# EAGLE design ME433Schematic (EAGLE 9.6.2)
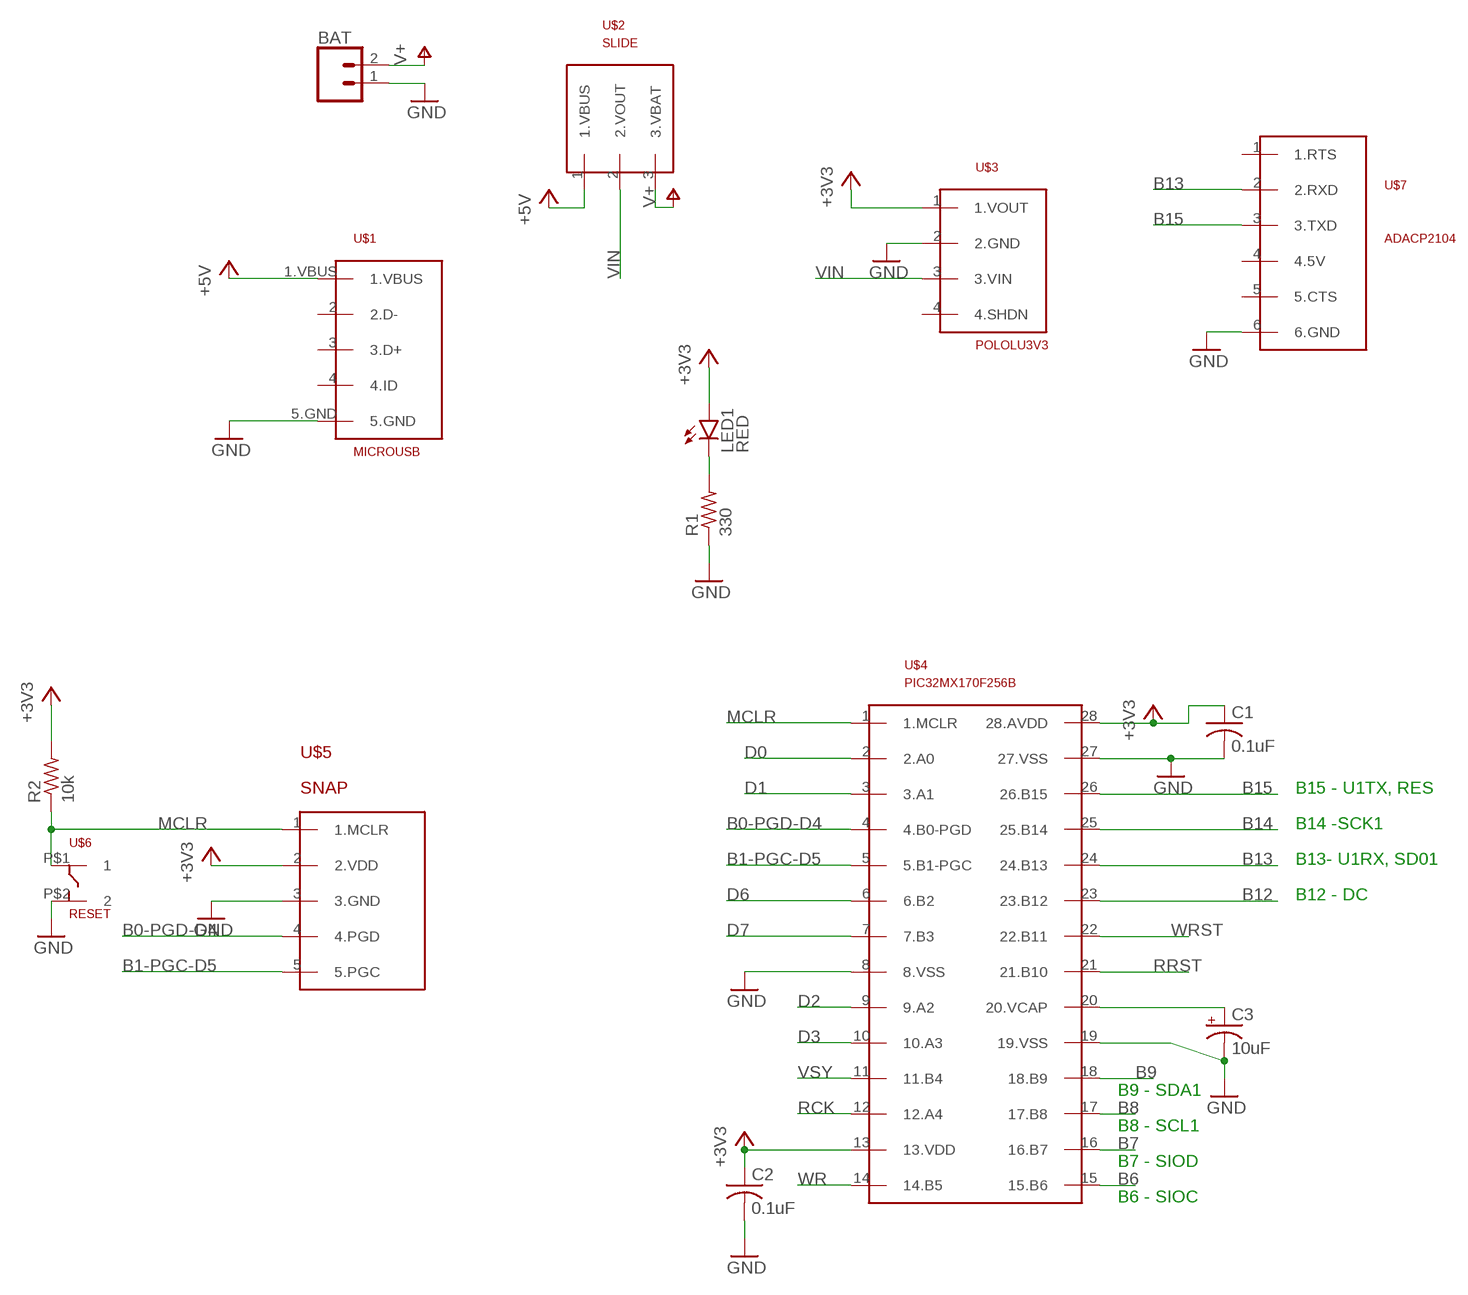
[diagram p0: schematic, sheet 1, part 1 of 2]
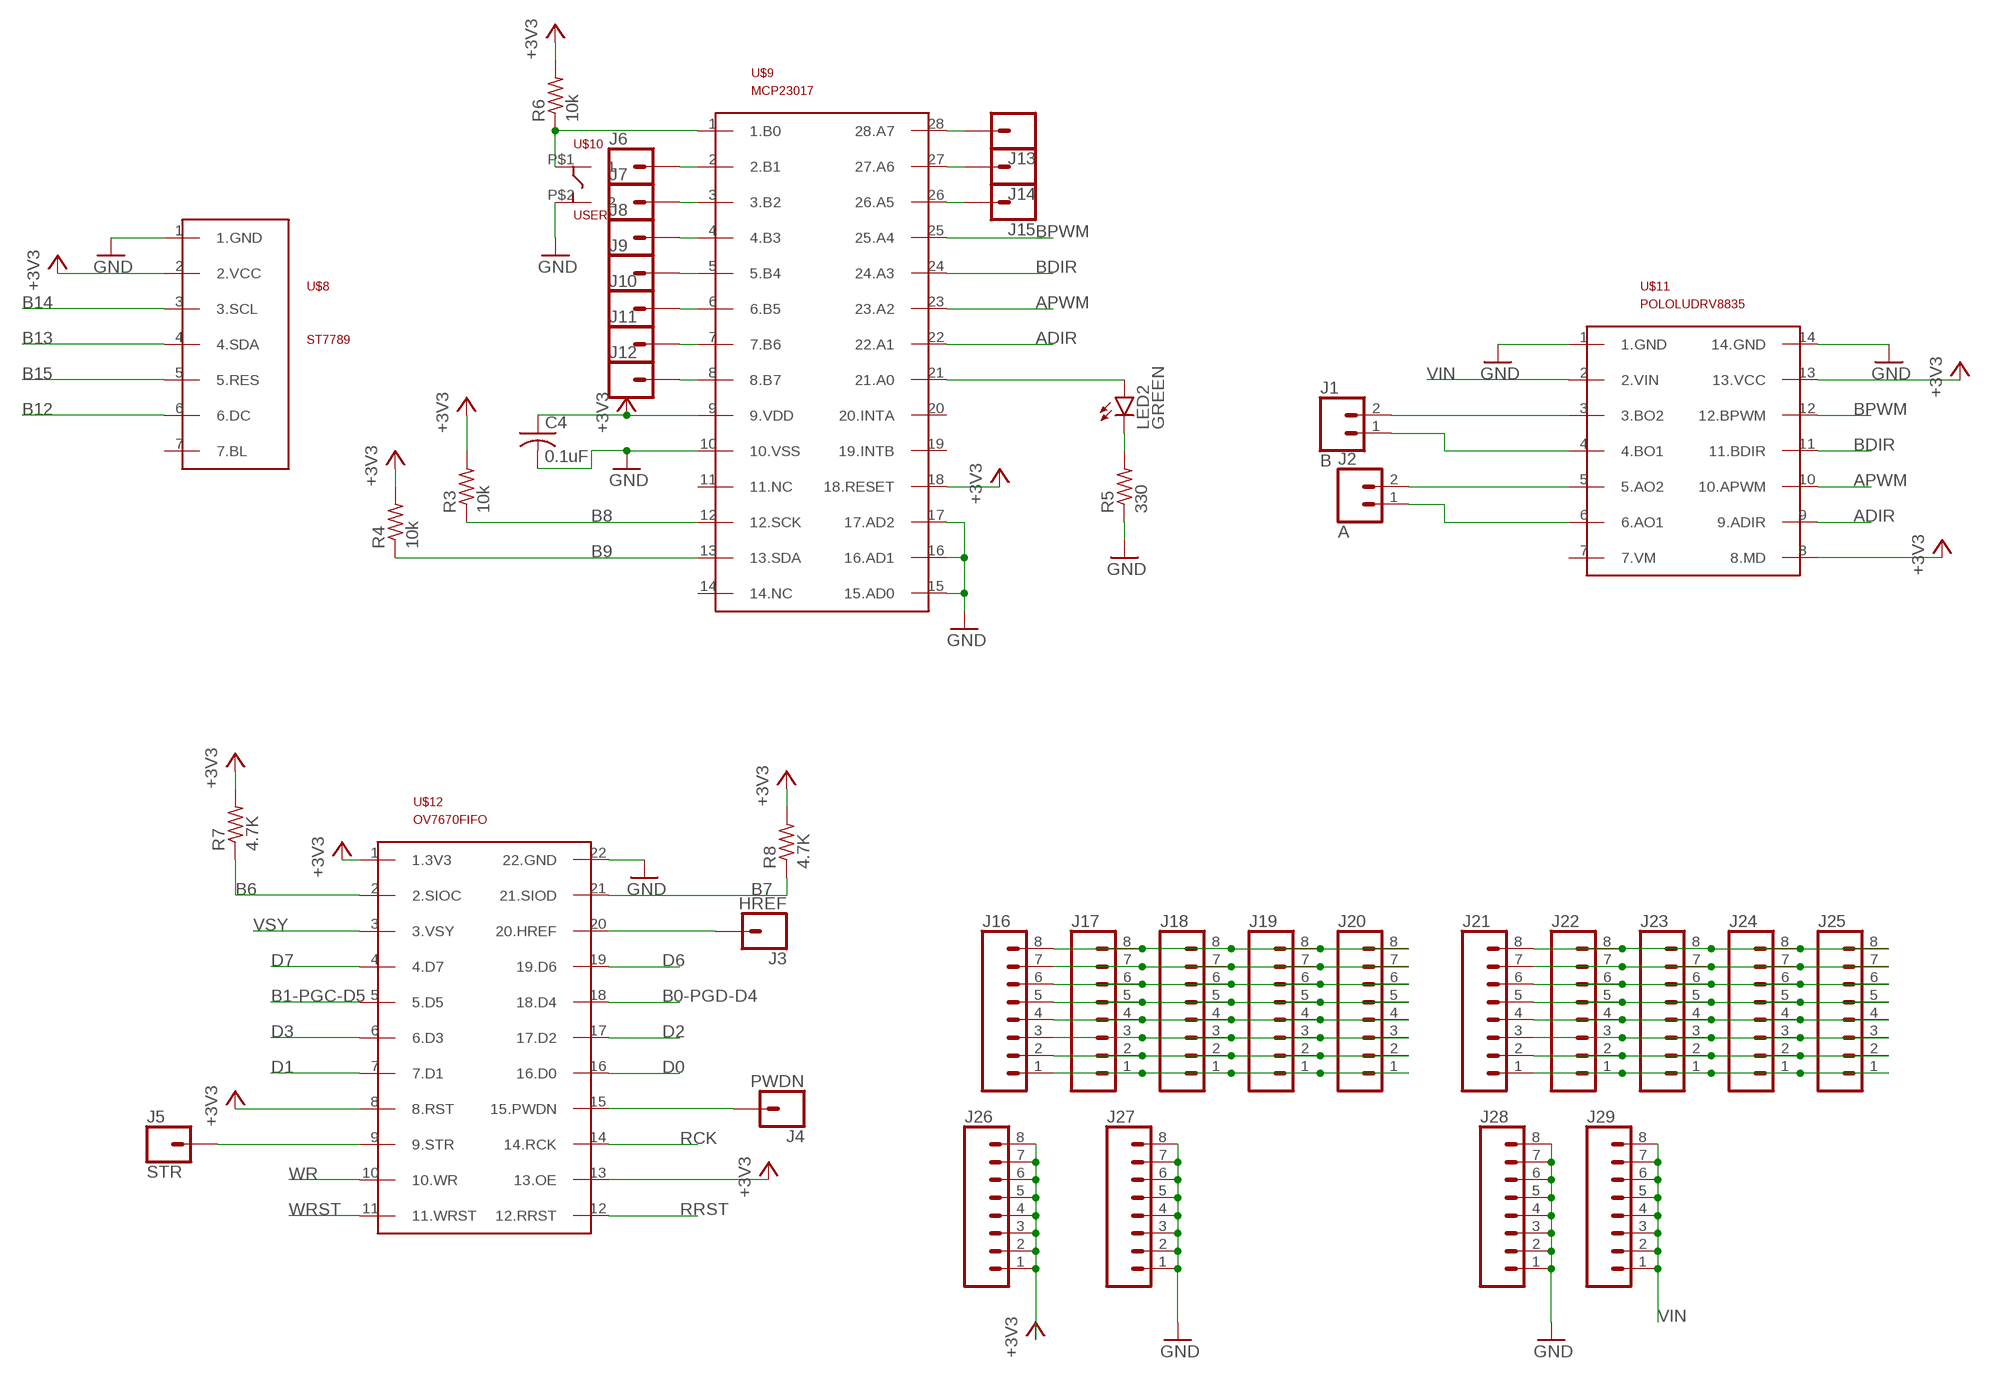
[diagram p1: schematic, sheet 1, part 2 of 2]

## Parts
BAT  CONN_02  [1X02]
C1  0.1uF  C-US025-030X050  [C025-030X050]
C2  0.1uF  C-US025-030X050  [C025-030X050]
C3  10uF  CPOL-USB45181B  [B45181B]
C4  0.1uF  C-US025-030X050  [C025-030X050]
J1  B  CONN_02  [1X02]
J2  A  CONN_02  [1X02]
J3  HREF  CONN_01  [1X01]
J4  PWDN  CONN_01  [1X01]
J5  STR  CONN_01  [1X01]
J6  CONN_01  [1X01]
J7  CONN_01  [1X01]
J8  CONN_01  [1X01]
J9  CONN_01  [1X01]
J10  CONN_01  [1X01]
J11  CONN_01  [1X01]
J12  CONN_01  [1X01]
J13  CONN_01  [1X01]
J14  CONN_01  [1X01]
J15  CONN_01  [1X01]
J16  CONN_08"  [1X08]
J17  CONN_08"  [1X08]
J18  CONN_08"  [1X08]
J19  CONN_08"  [1X08]
J20  CONN_08"  [1X08]
J21  CONN_08"  [1X08]
J22  CONN_08"  [1X08]
J23  CONN_08"  [1X08]
J24  CONN_08"  [1X08]
J25  CONN_08"  [1X08]
J26  CONN_08"  [1X08]
J27  CONN_08"  [1X08]
J28  CONN_08"  [1X08]
J29  CONN_08"  [1X08]
LED1  RED  LED3MM  [LED3MM]
LED2  GREEN  LED3MM  [LED3MM]
R1  330  R-US_0207/10  [0207/10]
R2  10k  R-US_0207/10  [0207/10]
R3  10k  R-US_0207/10  [0207/10]
R4  10k  R-US_0207/10  [0207/10]
R5  330  R-US_0207/10  [0207/10]
R6  10k  R-US_0207/10  [0207/10]
R7  4.7K  R-US_0207/10  [0207/10]
R8  4.7K  R-US_0207/10  [0207/10]
U$1  MICROUSB  [MICROUSB]
U$2  SLIDE  [SLIDE]
U$3  POLOLU3V3  [POLOLU3V3]
U$4  PIC32MX170F256B  [DIL28-3]
U$5  SNAP  [SNAP]
U$6  RESET  PUSH  [PUSH]
U$7  ADACP2104  [ADACP2104]
U$8  ST7789  [ST7789]
U$9  MCP23017  [DIL28-3]
U$10  USER  PUSH  [PUSH]
U$11  POLOLUDRV8835  [POLOLUDRV8835]
U$12  OV7670FIFO  [OV7670FIFO]

## Nets
+3V3: C1.1 C2.1 C4.1 J26.1 J26.2 J26.3 J26.4 J26.5 J26.6 J26.7 J26.8 LED1.A R2.2 R3.2 R4.2 R6.2 R7.2 R8.2 U$3.1(1.VOUT) U$4.13(13.VDD) U$4.28(28.AVDD) U$5.2(2.VDD) U$8.2(2.VCC) U$9.9(9.VDD) U$9.18(18.RESET) U$11.8(8.MD) U$11.13(13.VCC) U$12.1(1.3V3) U$12.8(8.RST) U$12.13(13.OE)
+5V: U$1.1.VBUS U$2.1(1.VBUS)
ADIR: U$9.22(22.A1) U$11.9(9.ADIR)
APWM: U$9.23(23.A2) U$11.10(10.APWM)
B0-PGD-D4: U$4.4(4.B0-PGD) U$5.4(4.PGD) U$12.18(18.D4)
B1-PGC-D5: U$4.5(5.B1-PGC) U$5.5(5.PGC) U$12.5(5.D5)
B6: R7.1 U$4.15(15.B6) U$12.2(2.SIOC)
B7: R8.1 U$4.16(16.B7) U$12.21(21.SIOD)
B8: R3.1 U$4.17(17.B8) U$9.12(12.SCK)
B9: R4.1 U$4.18(18.B9) U$9.13(13.SDA)
B12: U$4.23(23.B12) U$8.6(6.DC)
B13: U$4.24(24.B13) U$7.2(2.RXD) U$8.4(4.SDA)
B14: U$4.25(25.B14) U$8.3(3.SCL)
B15: U$4.26(26.B15) U$7.3(3.TXD) U$8.5(5.RES)
BDIR: U$9.24(24.A3) U$11.11(11.BDIR)
BPWM: U$9.25(25.A4) U$11.12(12.BPWM)
D0: U$4.2(2.A0) U$12.16(16.D0)
D1: U$4.3(3.A1) U$12.7(7.D1)
D2: U$4.9(9.A2) U$12.17(17.D2)
D3: U$4.10(10.A3) U$12.6(6.D3)
D6: U$4.6(6.B2) U$12.19(19.D6)
D7: U$4.7(7.B3) U$12.4(4.D7)
GND: BAT.1 C1.2 C2.2 C3.- C4.2 J27.1 J27.2 J27.3 J27.4 J27.5 J27.6 J27.7 J27.8 J28.1 J28.2 J28.3 J28.4 J28.5 J28.6 J28.7 J28.8 R1.1 R5.1 U$1.5.GND U$3.2(2.GND) U$4.8(8.VSS) U$4.19(19.VSS) U$4.27(27.VSS) U$5.3(3.GND) U$6.P$2 U$7.6(6.GND) U$8.1(1.GND) U$9.10(10.VSS) U$9.15(15.AD0) U$9.16(16.AD1) U$9.17(17.AD2) U$10.P$2 U$11.1(1.GND) U$11.14(14.GND) U$12.22(22.GND)
MCLR: R2.1 U$4.1(1.MCLR) U$5.1(1.MCLR) U$6.P$1
N$1: LED1.K(C) R1.2
N$2: C3.+ U$4.20(20.VCAP)
N$3: LED2.A U$9.21(21.A0)
N$4: J5.1 U$12.9(9.STR)
N$5: R6.1 U$9.1(1.B0) U$10.P$1
N$6: LED2.K(C) R5.2
N$7: J1.2 U$11.3(3.BO2)
N$8: J1.1 U$11.4(4.BO1)
N$9: J2.2 U$11.5(5.AO2)
N$10: J2.1 U$11.6(6.AO1)
N$11: J4.1 U$12.15(15.PWDN)
N$12: J3.1 U$12.20(20.HREF)
N$13: J6.1 U$9.2(2.B1)
N$14: J7.1 U$9.3(3.B2)
N$15: J8.1 U$9.4(4.B3)
N$16: J9.1 U$9.5(5.B4)
N$17: J10.1 U$9.6(6.B5)
N$18: J11.1 U$9.7(7.B6)
N$19: J12.1 U$9.8(8.B7)
N$20: J13.1 U$9.28(28.A7)
N$21: J14.1 U$9.27(27.A6)
N$22: J15.1 U$9.26(26.A5)
N$23: J16.8 J17.8 J18.8 J19.8 J20.8
N$24: J16.7 J17.7 J18.7 J19.7 J20.7
N$25: J16.6 J17.6 J18.6 J19.6 J20.6
N$26: J16.5 J17.5 J18.5 J19.5 J20.5
N$27: J16.4 J17.4 J18.4 J19.4 J20.4
N$28: J16.3 J17.3 J18.3 J19.3 J20.3
N$29: J16.2 J17.2 J18.2 J19.2 J20.2
N$30: J16.1 J17.1 J18.1 J19.1 J20.1
N$31: J21.8 J22.8 J23.8 J24.8 J25.8
N$32: J21.7 J22.7 J23.7 J24.7 J25.7
N$33: J21.6 J22.6 J23.6 J24.6 J25.6
N$34: J21.5 J22.5 J23.5 J24.5 J25.5
N$35: J21.4 J22.4 J23.4 J24.4 J25.4
N$36: J21.3 J22.3 J23.3 J24.3 J25.3
N$37: J21.2 J22.2 J23.2 J24.2 J25.2
N$38: J21.1 J22.1 J23.1 J24.1 J25.1
RCK: U$4.12(12.A4) U$12.14(14.RCK)
RRST: U$4.21(21.B10) U$12.12(12.RRST)
V+: BAT.2 U$2.3(3.VBAT)
VIN: J29.1 J29.2 J29.3 J29.4 J29.5 J29.6 J29.7 J29.8 U$2.2(2.VOUT) U$3.3(3.VIN) U$11.2(2.VIN)
VSY: U$4.11(11.B4) U$12.3(3.VSY)
WR: U$4.14(14.B5) U$12.10(10.WR)
WRST: U$4.22(22.B11) U$12.11(11.WRST)
Unconnected: U$1.2(2.D-) U$1.3(3.D+) U$1.4(4.ID) U$3.4(4.SHDN) U$7.1(1.RTS) U$7.4(4.5V) U$7.5(5.CTS) U$8.7(7.BL) U$9.11(11.NC) U$9.14(14.NC) U$9.19(19.INTB) U$9.20(20.INTA) U$11.7(7.VM)

## Notes on the sheet
- B15 - U1TX, RES
- B14 -SCK1
- B13- U1RX, SD01
- B12 - DC
- B9 - SDA1
- B8 - SCL1
- B7 - SIOD
- B6 - SIOC

## Library data of the parts
BAT J1 J2 = ME433Library:CONN_02: Multi connection point. Often used as Generic Header-pin footprint for 0.1 inch spaced/style header connections On any of the 0.1 inch spaced packages, you can populate with these: Break Away Headers - Straight <https://www.sparkfun.com/products/116> (PRT-00116) Break Away Male Headers - Right Angle <https://www.sparkfun.com/products/553> (PRT-00553) Female Headers <https://www.sparkfun.com/products/115> (PRT-00115) Break Away Headers - Machine Pin <https://www.sparkfun.com/products/117> (PRT-00117) Break Away Female Headers - Swiss Machine Pin <https://www.sparkfun.com/products/743> (PRT-00743) For SCREWTERMINALS and SPRING TERMINALS visit here: Screw Terimnals on SparkFun.com <https://www.sparkfun.com/search/results?term=Screw+Terminals> (5mm/3.5mm/2.54mm spacing) This device is also useful as a general connection point to wire up your design to another part of your project. Our various solder wires solder well into these plated through hole pads. Hook-Up Wire - Assortment (Stranded, 22 AWG) <https://www.sparkfun.com/products/11375> (PRT-11375) Hook-Up Wire - Assortment (Solid Core, 22 AWG) <https://www.sparkfun.com/products/11367> (PRT-11367) View the entire wire category on our website here <https://www.sparkfun.com/categories/141> Special notes: Molex polarized connector foot print use with: PRT-08233 with associated crimp pins and housings. 2.54_SCREWTERM for use with PRT-10571. 3.5mm Screw Terminal footprints for PRT-08084 5mm Screw Terminal footprints for use with PRT-08432
C1 C2 C4 = ME433Library:C-US: CAPACITOR, American symbol; SPICEPREFIX: C
C3 = ME433Library:CPOL-US: POLARIZED CAPACITOR, American symbol; SPICEPREFIX: C
J3-J15 = ME433Library:CONN_01: Single connection point. Often used as Generic Header-pin footprint for 0.1 inch spaced/style header connections On any of the 0.1 inch spaced packages, you can populate with these: Break Away Headers - Straight <https://www.sparkfun.com/products/116> (PRT-00116) Break Away Male Headers - Right Angle <https://www.sparkfun.com/products/553> (PRT-00553) Female Headers <https://www.sparkfun.com/products/115> (PRT-00115) Break Away Headers - Machine Pin <https://www.sparkfun.com/products/117> (PRT-00117) Break Away Female Headers - Swiss Machine Pin <https://www.sparkfun.com/products/743> (PRT-00743) This device is also useful as a general connection point to wire up your design to another part of your project. Our various solder wires solder well into these plated through hole pads. Hook-Up Wire - Assortment (Stranded, 22 AWG) <https://www.sparkfun.com/products/11375> (PRT-11375) Hook-Up Wire - Assortment (Solid Core, 22 AWG) <https://www.sparkfun.com/products/11367> (PRT-11367) View the entire wire category on our website here <https://www.sparkfun.com/categories/141> Special notes: SMTSO-256-ET is a "flush mount" nut for a 4-40 screw. We mostly use this on specialty testbeds; it is a nice way to connect hardware to your PCB at an adjustable hieght. Also note, the SNAP packages are for using a snappable style connector. We sell a baggie of snaps and they are also used on two LilyPad designs: Snap Assortment - 30 pack (male and female) <https://www.sparkfun.com/products/11347> (DEV-11347) LilyPad Arduino SimpleSnap <https://www.sparkfun.com/products/10941> (DEV-10941) LilyPad SimpleSnap Protoboard <https://www.sparkfun.com/products/10940> (DEV-10940)
J16-J29 = ME433Library:CONN_08: Multi connection point. Often used as Generic Header-pin footprint for 0.1 inch spaced/style header connections On any of the 0.1 inch spaced packages, you can populate with these: Break Away Headers - Straight <https://www.sparkfun.com/products/116> (PRT-00116) Break Away Male Headers - Right Angle <https://www.sparkfun.com/products/553> (PRT-00553) Female Headers <https://www.sparkfun.com/products/115> (PRT-00115) Break Away Headers - Machine Pin <https://www.sparkfun.com/products/117> (PRT-00117) Break Away Female Headers - Swiss Machine Pin <https://www.sparkfun.com/products/743> (PRT-00743) Arduino Stackable Header - 8 Pin <https://www.sparkfun.com/products/9279> (PRT-09279) For SCREWTERMINALS and SPRING TERMINALS visit here: Screw Terimnals on SparkFun.com <https://www.sparkfun.com/search/results?term=Screw+Terminals> (5mm/3.5mm/2.54mm spacing) This device is also useful as a general connection point to wire up your design to another part of your project. Our various solder wires solder well into these plated through hole pads. Hook-Up Wire - Assortment (Stranded, 22 AWG) <https://www.sparkfun.com/products/11375> (PRT-11375) Hook-Up Wire - Assortment (Solid Core, 22 AWG) <https://www.sparkfun.com/products/11367> (PRT-11367) View the entire wire category on our website here <https://www.sparkfun.com/categories/141> Special notes: Molex polarized connector foot print use with SKU : PRT-08231 with associated crimp pins and housings. 1MM SMD Version SKU: PRT-10208 NOTES ON THE VARIANTS LOCK and LOCK_LONGPADS... This footprint was designed to help hold the alignment of a through-hole component (i.e. 6-pin header) while soldering it into place. You may notice that each hole has been shifted either up or down by 0.005 of an inch from it's more standard position (which is a perfectly straight line). This slight alteration caused the pins (the squares in the middle) to touch the edges of the holes. Because they are alternating, it causes a "brace" to hold the component in place. 0.005 has proven to be the perfect amount of "off-center" position when using our standard breakaway headers. Although looks a little odd when you look at the bare footprint, once you have a header in there, the alteration is very hard to notice. Also,if you push a header all the way into place, it is covered up entirely on the bottom side.; PROD_ID: CONN-08438
LED1 LED2 = ME433Library:LED: LED OSRAM: - CHIPLED LG R971, LG N971, LY N971, LG Q971, LY Q971, LO R971, LY R971 LH N974, LH R974 LS Q976, LO Q976, LY Q976 LO Q996 - Hyper CHIPLED LW Q18S LB Q993, LB Q99A, LB R99A - SideLED LS A670, LO A670, LY A670, LG A670, LP A670 LB A673, LV A673, LT A673, LW A673 LH A674 LY A675 LS A676, LA A676, LO A676, LY A676, LW A676 LS A679, LY A679, LG A679 - Hyper Micro SIDELED® LS Y876, LA Y876, LO Y876, LY Y876 LT Y87S - SmartLED LW L88C, LW L88S LB L89C, LB L89S, LG L890 LS L89K, LO L89K, LY L89K LS L896, LA L896, LO L896, LY L896 - TOPLED LS T670, LO T670, LY T670, LG T670, LP T670 LSG T670, LSP T670, LSY T670, LOP T670, LYG T670 LG T671, LOG T671, LSG T671 LB T673, LV T673, LT T673, LW T673 LH T674 LS T676, LA T676, LO T676, LY T676, LB T676, LH T676, LSB T676, LW T676 LB T67C, LV T67C, LT T67C, LS T67K, LO T67K, LY T67K, LW E67C LS E67B, LA E67B, LO E67B, LY E67B, LB E67C, LV E67C, LT E67C LW T67C LS T679, LY T679, LG T679 LS T770, LO T770, LY T770, LG T770, LP T770 LB T773, LV T773, LT T773, LW T773 LH T774 LS E675, LA E675, LY E675, LS T675 LS T776, LA T776, LO T776, LY T776, LB T776 LHGB T686 LT T68C, LB T68C - Hyper Mini TOPLED® LB M676 - Mini TOPLED Santana® LG M470 LS M47K, LO M47K, LY M47K Source: http://www.osram.convergy.de LUXEON: - LUMILED® LXK2-PW12-R00, LXK2-PW12-S00, LXK2-PW14-U00, LXK2-PW14-V00 LXK2-PM12-R00, LXK2-PM12-S00, LXK2-PM14-U00 LXK2-PE12-Q00, LXK2-PE12-R00, LXK2-PE12-S00, LXK2-PE14-T00, LXK2-PE14-U00 LXK2-PB12-K00, LXK2-PB12-L00, LXK2-PB12-M00, LXK2-PB14-N00, LXK2-PB14-P00, LXK2-PB14-Q00 LXK2-PR12-L00, LXK2-PR12-M00, LXK2-PR14-Q00, LXK2-PR14-R00 LXK2-PD12-Q00, LXK2-PD12-R00, LXK2-PD12-S00 LXK2-PH12-R00, LXK2-PH12-S00 LXK2-PL12-P00, LXK2-PL12-Q00, LXK2-PL12-R00 Source: www.luxeon.com KINGBRIGHT: KA-3528ASYC Source: www.kingbright.com
R1-R8 = ME433Library:R-US_: RESISTOR, American symbol; SPICEPREFIX: R
U$1 = ME433Library:MICROUSB
U$2 = ME433Library:SLIDE
U$3 = ME433Library:POLOLU3V3
U$4 = ME433Library:PIC32MX170F256B
U$5 = ME433Library:SNAP
U$6 U$10 = ME433Library:PUSH
U$7 = ME433Library:ADACP2104
U$8 = ME433Library:ST7789
U$9 = ME433Library:MCP23017
U$11 = ME433Library:POLOLUDRV8835
U$12 = ME433Library:OV7670FIFO

## Board
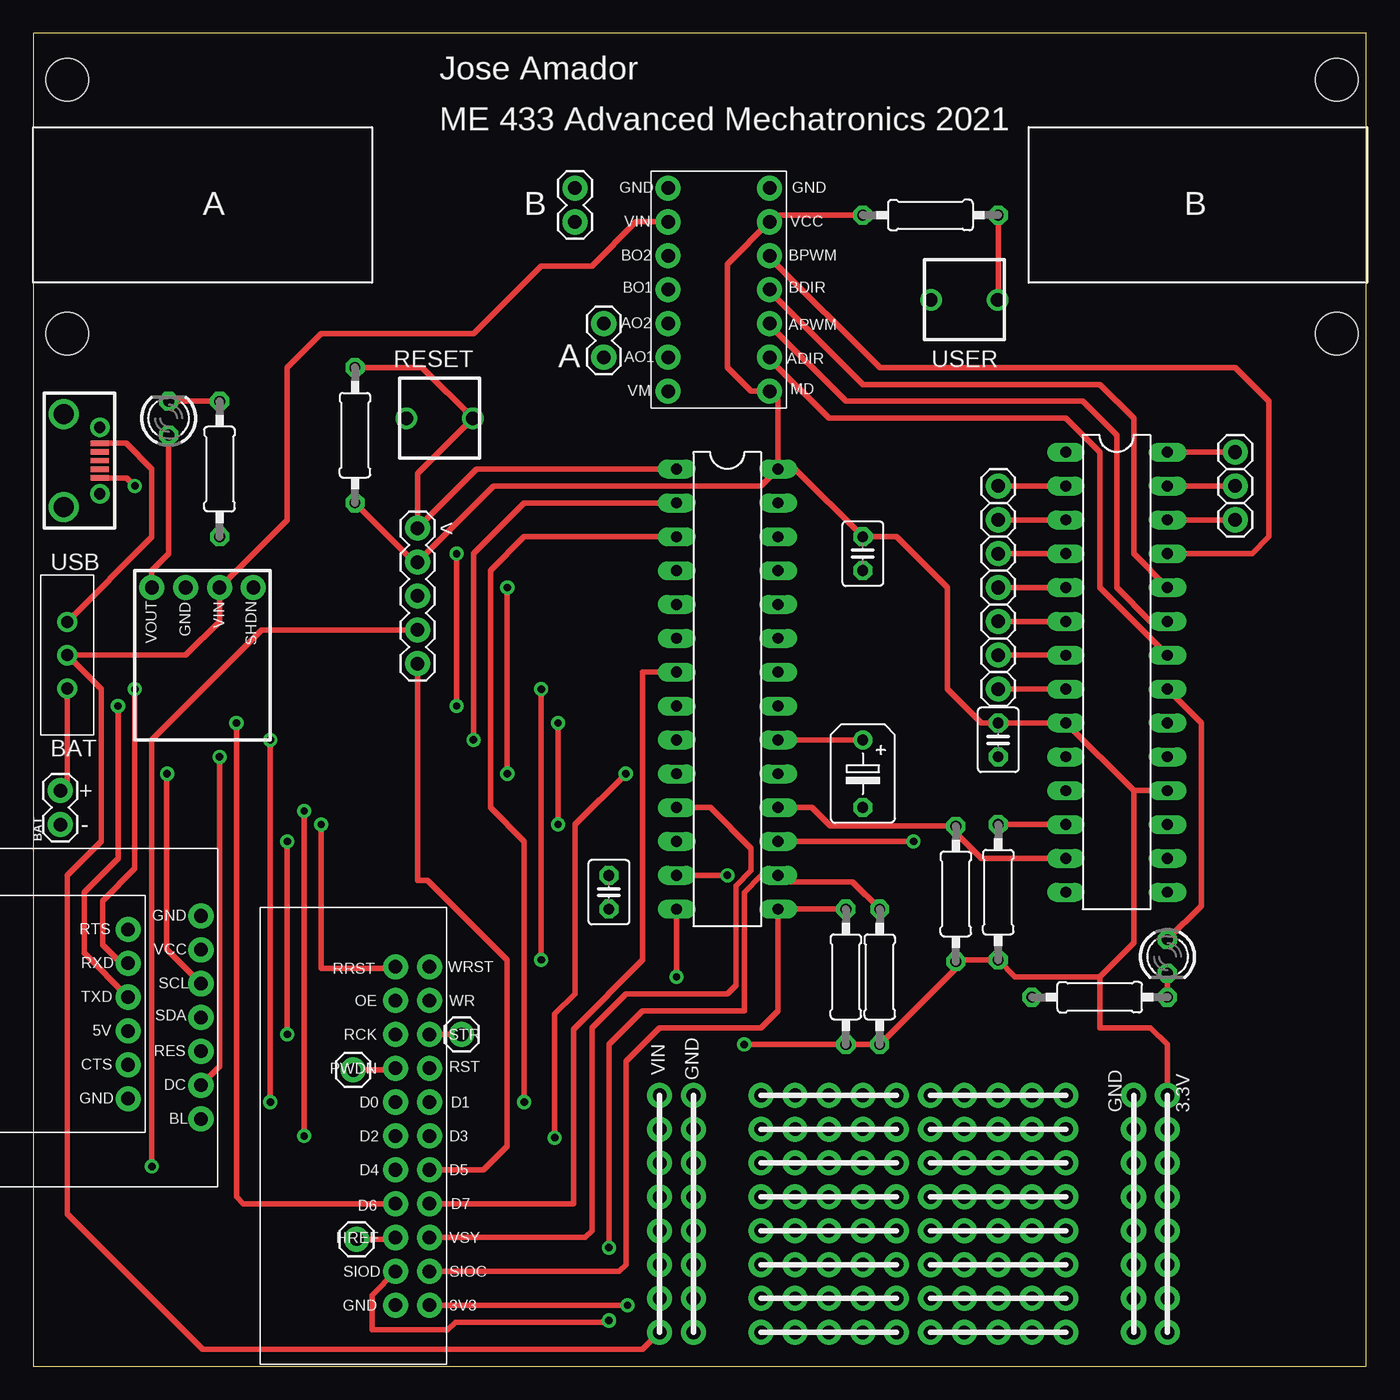
[diagram p2: board, top side]
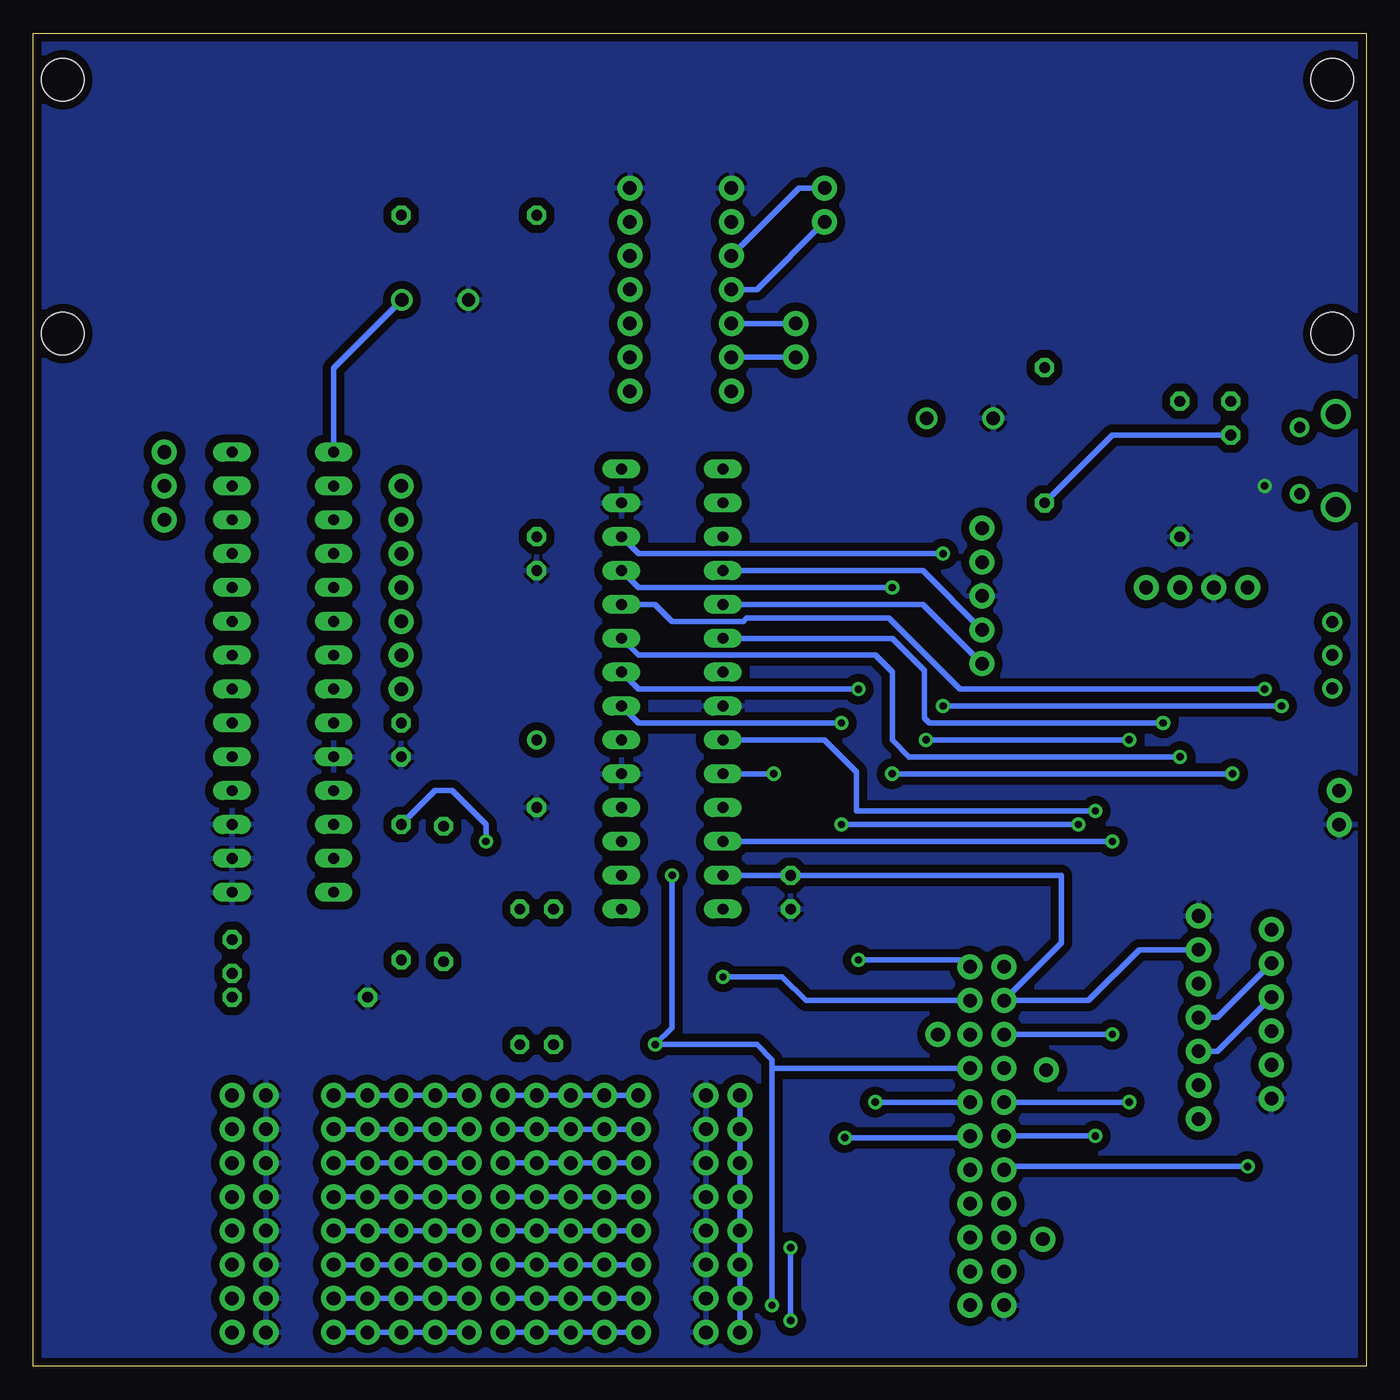
[diagram p3: board, bottom side, seen from below]

Size 100 x 100 mm. Coordinates in mm from the lower left corner, seen from the top.
Outline: 0,0 100,0 100,100 0,100 0,0
Copper layers (1*16): Top 0.035mm / dielectric 1.5mm / Bottom 0.035mm
Design rules "SparkFun": minimum track width 8mil, minimum drill 20mil, track to track 8mil, track to pad 8mil, pad to pad 8mil, via to via 8mil, smd to smd 8mil, copper to edge 8mil, drill to drill 8mil, minimum pad ring 12mil, minimum via ring 10mil, stop-mask expansion 4mil, vias tented up to drill 20mil, thermal gap 10mil
Holes 3.17 mm at 2.54,96.52 2.54,77.47 97.79,96.52 97.79,77.47

### Footprints (pad centres in the part's own frame; a part is rotated, then mirrored left to right if it is on the bottom)
1X02 = drill 1.016 pad 1.88: 1 0,0; 2 2.54,0
C025-030X050 = drill 0.813 octagon: 1 -1.27,0; 2 1.27,0
B45181B = drill 0.813: + -2.54,0 | drill 0.813 octagon: - 2.54,0
1X01 = drill 1.016 pad 1.88: 1 0,0
1X08 = drill 1.016 pad 1.88: 1 0,0; 2 2.54,0; 3 5.08,0; 4 7.62,0; 5 10.16,0; 6 12.7,0; 7 15.24,0; 8 17.78,0
LED3MM = drill 0.813 octagon: A -1.27,0; K 1.27,0
0207/10 = drill 0.813 octagon: 1 -5.08,0; 2 5.08,0
MICROUSB = smd 0.4 x 1.35: 1.VBUS -1.3,2.7; 2 -0.65,2.7; 3 0,2.7; 4 0.65,2.7; 5.GND 1.3,2.7 | drill 0.85: P$6 -2.5,2.7; P$7 2.5,2.7 | drill 1.5: P$8 -3.5,0; P$9 3.5,0
SLIDE = drill 0.9: 1 -2.5,0; 2 0,0; 3 2.5,0
POLOLU3V3 = drill 1.016 pad 1.88: 1 0,3.81; 2 0,1.27; 3 0,-1.27; 4 0,-3.81
DIL28-3 = drill 0.813 long: 1 -16.51,-3.81; 2 -13.97,-3.81; 3 -11.43,-3.81; 4 -8.89,-3.81; 5 -6.35,-3.81; 6 -3.81,-3.81; 7 -1.27,-3.81; 8 1.27,-3.81; 9 3.81,-3.81; 10 6.35,-3.81; 11 8.89,-3.81; 12 11.43,-3.81; 13 13.97,-3.81; 14 16.51,-3.81; 15 16.51,3.81; 16 13.97,3.81; 17 11.43,3.81; 18 8.89,3.81; 19 6.35,3.81; 20 3.81,3.81; 21 1.27,3.81; 22 -1.27,3.81; 23 -3.81,3.81; 24 -6.35,3.81; 25 -8.89,3.81; 26 -11.43,3.81; 27 -13.97,3.81; 28 -16.51,3.81
SNAP = drill 1.016 pad 1.88: 1 0,5.08; 2 0,2.54; 3 0,0; 4 0,-2.54; 5 0,-5.08
PUSH = drill 1: P$1 -2.5,0; P$2 2.5,0
ADACP2104 = drill 1.016 pad 1.88: 1 0,6.35; 2 0,3.81; 3 0,1.27; 4 0,-1.27; 5 0,-3.81; 6 0,-6.35
ST7789 = drill 1.016 pad 1.88: 1 0,7.62; 2 0,5.08; 3 0,2.54; 4 0,0; 5 0,-2.54; 6 0,-5.08; 7 0,-7.62
POLOLUDRV8835 = drill 1.016 pad 1.88: 1 -3.81,7.62; 2 -3.81,5.08; 3 -3.81,2.54; 4 -3.81,0; 5 -3.81,-2.54; 6 -3.81,-5.08; 7 -3.81,-7.62; 8 3.81,-7.62; 9 3.81,-5.08; 10 3.81,-2.54; 11 3.81,0; 12 3.81,2.54; 13 3.81,5.08; 14 3.81,7.62
OV7670FIFO = drill 1.016 pad 1.88: 1 0,12.7; 2 0,10.16; 3 0,7.62; 4 0,5.08; 5 0,2.54; 6 0,0; 7 0,-2.54; 8 0,-5.08; 9 0,-7.62; 10 0,-10.16; 11 0,-12.7; 12 2.54,-12.7; 13 2.54,-10.16; 14 2.54,-7.62; 15 2.54,-5.08; 16 2.54,-2.54; 17 2.54,0; 18 2.54,2.54; 19 2.54,5.08; 20 2.54,7.62; 21 2.54,10.16; 22 2.54,12.7

### Placement (x,y rotation side)
BAT  2.03,40.64 90 top
C1  62.23,60.96 270 top
C2  43.18,35.56 270 top
C3  62.23,44.45 270 top
C4  72.39,46.99 270 top
J1  40.64,85.85 90 top
J2  42.8,75.69 90 top
J3  24.26,9.53 90 top
J4  24,22.23 90 top
J5  32.13,24.89 90 top
J6  72.39,66.04 90 top
J7  72.39,63.5 90 top
J8  72.39,60.96 90 top
J9  72.39,58.42 90 top
J10  72.39,55.88 90 top
J11  72.39,53.34 90 top
J12  72.39,50.8 90 top
J13  90.17,68.58 90 top
J14  90.17,66.04 90 top
J15  90.17,63.5 90 top
J16  54.61,2.54 90 top
J17  57.15,2.54 90 top
J18  59.69,2.54 90 top
J19  62.23,2.54 90 top
J20  64.77,2.54 90 top
J21  67.31,2.54 90 top
J22  69.85,2.54 90 top
J23  72.39,2.54 90 top
J24  74.93,2.54 90 top
J25  77.47,2.54 90 top
J26  85.09,2.54 90 top
J27  49.53,2.54 90 top
J28  82.55,2.54 90 top
J29  46.99,2.54 90 top
LED1  10.16,71.12 90 top
LED2  85.09,30.73 270 top
R1  13.97,67.31 90 top
R2  24.13,69.85 270 top
R3  72.39,35.56 270 top
R4  69.22,35.43 270 top
R5  80.01,27.69 0 top
R6  67.31,86.36 180 top
R7  60.96,29.21 270 top
R8  63.5,29.21 270 top
U$1  2.29,67.94 270 top
U$2  2.54,53.34 270 top
U$3  12.7,58.42 90 top
U$4  52.07,50.8 270 top
U$5  28.83,57.78 0 top
U$6  30.48,71.12 180 top
U$7  7.11,26.42 0 top
U$8  12.57,26.16 0 top
U$9  81.28,52.07 270 top
U$10  69.85,80.01 180 top
U$11  51.44,80.77 0 top
U$12  29.72,17.27 180 top

### Tracks (layer width: path | path; a pad name or v marks a point on that pad's centre or on a via)
+3V3  (via drill 0.55)
  Top 0.406: R2.2 28.57,60.33 U$5.2 34.54,66.04 54.61,66.04 U$4.28 | U$4.28 57.15,67.31 C1.1 64.77,62.23 68.58,58.42 68.58,50.8 71.12,48.26 C4.1 U$9.9 82.55,43.18 | U$4.28 55.88,72.52 U$11.8 53.85,73.15 52.07,74.93 52.07,82.68 U$11.13 55.75,86.36 R6.2 | 82.55,43.18 U$9.18 | 80.01,29.21 73.66,29.21 R3.2 69.34,30.48 R4.2 69.22,29.84 R8.2 R7.2 v53.34,24.13 | 80.01,29.21 82.55,31.75 82.55,43.18 | J26.1 J26.2 J26.3 J26.4 J26.5 J26.6 J26.7 J26.8 85.09,24.13 83.82,25.4 80.01,25.4 80.01,29.21 | U$4.13 v52.07,36.83 | U$3.1 8.89,59.69 10.16,60.96 LED1.A | v44.58,4.57 U$12.1
  Bottom 0.406: LED1.A 19.05,69.85 R2.2 | v52.07,36.83 52.07,25.4 v53.34,24.13 45.72,24.13 44.58,22.99 44.58,22.23 | U$4.13 C2.1 22.86,36.83 22.86,31.75 U$12.13 20.83,27.43 17.02,31.24 U$8.2 | 44.58,22.23 v44.58,4.57 | U$12.8 44.45,22.35 44.58,22.23
+5V
  Top 0.406: U$1.1.VBUS 6.96,69.25 8.89,67.31 8.89,62.19 U$2.1
ADIR
  Top 0.406: U$9.22 80.01,58.42 80.01,68.58 77.47,71.12 59.69,71.12 55.24,75.56 U$11.9
APWM
  Top 0.406: U$9.23 83.82,55.88 81.28,58.42 81.28,69.85 78.74,72.39 60.96,72.39 55.24,78.11 U$11.10
B0-PGD-D4  (via drill 0.55)
  Top 0.406: U$5.4 17.14,55.24 8.89,46.99 v8.89,14.99
  Bottom 0.406: U$5.4 33.27,59.69 U$4.4 | v8.89,14.99 26.92,14.99 U$12.18
B1-PGC-D5
  Top 0.406: U$5.5 28.83,36.83 28.83,36.7 28.83,36.45 29.59,36.45 35.56,30.48 35.56,16.51 33.78,14.73 U$12.5
  Bottom 0.406: U$5.5 33.27,57.15 U$4.5
B6
  Top 0.406: R7.1 U$4.15 55.88,26.67 54.61,25.4 46.99,25.4 44.45,22.86 44.45,7.62 43.94,7.11 U$12.2
B7  (via drill 0.55)
  Top 0.406: R8.1 61.47,36.32 56.39,36.32 U$4.16 54.61,36.83 53.34,35.56 53.34,26.67 45.72,26.67 43.18,24.13 v43.18,8.89 | v43.18,3.43 43.05,3.3 31.68,3.3 31.09,2.72 25.4,2.72 25.4,5.33 U$12.21
  Bottom 0.406: v43.18,8.89 v43.18,3.43
B8  (via drill 0.55)
  Top 0.406: R3.1 U$9.12 | U$4.17 v66.04,39.37
  Bottom 0.406: v66.04,39.37 66.04,40.64 68.58,43.18 69.85,43.18 R3.1
B9
  Top 0.406: U$9.13 71.12,38.1 69.22,40.01 R4.1 59.82,40.51 58.42,41.91 U$4.18
B12  (via drill 0.55)
  Top 0.406: v13.97,45.72 13.97,22.48 U$8.6
  Bottom 0.406: U$4.23 54.61,53.34 36.83,53.34 35.56,52.07 35.56,46.99 34.29,45.72 v13.97,45.72
B13  (via drill 0.55)
  Top 0.406: v7.62,50.8 7.62,37.34 5.21,34.92 5.21,31.62 6.6,30.23 U$7.2
  Bottom 0.406: U$7.2 11.18,26.16 U$8.4 | v7.62,50.8 30.48,50.8 35.81,56.13 46.48,56.13 46.74,55.88 52.07,55.88 53.34,57.15 U$4.24
B14  (via drill 0.55)
  Top 0.406: v35.56,58.42 v35.56,44.45 | U$8.3 10.01,31.27 10.01,44.42 v10.03,44.45
  Bottom 0.406: U$4.25 54.61,58.42 v35.56,58.42 | v35.56,44.45 v10.03,44.45
B15  (via drill 0.55)
  Top 0.406: v31.75,60.96 v31.75,49.53 | v6.35,49.53 6.35,38.1 3.81,35.56 3.81,30.99 U$7.3
  Bottom 0.406: U$7.3 11.18,23.62 U$8.5 | U$4.26 54.61,60.96 v31.75,60.96 | v31.75,49.53 v6.35,49.53
BDIR
  Top 0.406: U$9.24 82.55,60.96 82.55,71.12 80.01,73.66 62.23,73.66 55.24,80.64 U$11.11
BPWM
  Top 0.406: U$9.25 91.44,60.96 92.71,62.23 92.71,72.39 90.17,74.93 63.5,74.93 55.24,83.19 U$11.12
D0  (via drill 0.55)
  Top 0.406: U$4.2 36.83,64.77 33.02,60.96 v33.02,46.99 | v17.78,46.99 v17.78,19.81
  Bottom 0.406: v33.02,46.99 v17.78,46.99 | v17.78,19.81 U$12.16
D1  (via drill 0.55)
  Top 0.406: U$4.3 36.83,62.23 34.29,59.69 34.29,41.91 36.83,39.37 v36.83,19.81
  Bottom 0.406: U$12.7 v36.83,19.81
D2  (via drill 0.55)
  Top 0.406: v20.32,41.66 v20.32,17.27
  Bottom 0.406: U$4.9 40.64,46.99 38.23,44.58 38.23,41.66 v20.32,41.66 | v20.32,17.27 U$12.17
D3  (via drill 0.55)
  Top 0.406: v44.45,44.45 40.64,40.64 40.64,27.94 39.12,26.42 v39.12,17.14
  Bottom 0.406: U$4.10 v44.45,44.45 | v39.12,17.14 29.84,17.14 U$12.6
D6  (via drill 0.55)
  Top 0.406: U$12.19 15.75,12.19 15.24,12.7 v15.24,48.26
  Bottom 0.406: U$4.6 35.56,54.61 33.15,52.2 33.15,48.64 32.77,48.26 v15.24,48.26
D7
  Top 0.406: U$4.7 45.72,52.07 45.72,30.48 40.51,25.27 40.51,12.19 U$12.4
GND  (via drill 0.55)
  Top 0.406: U$1.5.GND 7.01,66.64 v7.62,66.04
  pour Bottom (isolate 0.61): 0,0 100.33,0 100.33,100.33 0,100.33
MCLR
  Top 0.406: U$4.1 33.27,67.31 U$5.1 28.83,66.97 U$6.P$1 29.17,74.93 R2.1
N$1
  Top 0.406: LED1.K R1.2
N$2
  Top 0.406: C3.+ U$4.20
N$3
  Top 0.406: LED2.A 87.63,34.54 87.63,48.26 U$9.21
N$4
  Top 0.406: U$12.9 J5.1
N$5
  Top 0.406: R6.1 72.39,80.05 U$10.P$1
  Bottom 0.406: U$10.P$1 77.47,74.89 U$9.1
N$6
  Top 0.406: LED2.K R5.2
N$7
  Bottom 0.406: J1.2 42.55,88.39 U$11.3
N$8
  Bottom 0.406: J1.1 45.72,80.77 U$11.4
N$9
  Bottom 0.406: J2.2 U$11.5
N$10
  Bottom 0.406: J2.1 U$11.6
N$11
  Top 0.406: J4.1 27.05,22.23 U$12.15
N$12
  Top 0.406: J3.1 27.05,9.53 U$12.20
N$13
  Top 0.406: J6.1 U$9.2
N$14
  Top 0.406: J7.1 U$9.3
N$15
  Top 0.406: J8.1 U$9.4
N$16
  Top 0.406: J9.1 U$9.5
N$17
  Top 0.406: J10.1 U$9.6
N$18
  Top 0.406: J11.1 U$9.7
N$19
  Top 0.406: J12.1 U$9.8
N$20
  Top 0.406: U$9.28 J13.1
N$21
  Top 0.406: U$9.27 J14.1
N$22
  Top 0.406: U$9.26 J15.1
N$23
  Bottom 0.406: J16.8 J17.8 J18.8 J19.8 J20.8
N$24
  Bottom 0.406: J16.7 J17.7 J18.7 J19.7 J20.7
N$25
  Bottom 0.406: J16.6 J17.6 J18.6 J19.6 J20.6
N$26
  Bottom 0.406: J16.5 J17.5 J18.5 J19.5 J20.5
N$27
  Bottom 0.406: J16.4 J17.4 J18.4 J19.4 J20.4
N$28
  Bottom 0.406: J16.3 J17.3 J18.3 J19.3 J20.3
N$29
  Bottom 0.406: J16.2 J17.2 J18.2 J19.2 J20.2
N$30
  Bottom 0.406: J16.1 J17.1 J18.1 J19.1 J20.1
N$31
  Bottom 0.406: J21.8 J22.8 J23.8 J24.8 J25.8
N$32
  Bottom 0.406: J21.7 J22.7 J23.7 J24.7 J25.7
N$33
  Bottom 0.406: J21.6 J22.6 J23.6 J24.6 J25.6
N$34
  Bottom 0.406: J21.5 J22.5 J23.5 J24.5 J25.5
N$35
  Bottom 0.406: J21.4 J22.4 J23.4 J24.4 J25.4
N$36
  Bottom 0.406: J21.3 J22.3 J23.3 J24.3 J25.3
N$37
  Bottom 0.406: J21.2 J22.2 J23.2 J24.2 J25.2
N$38
  Bottom 0.406: J21.1 J22.1 J23.1 J24.1 J25.1
RCK  (via drill 0.55)
  Top 0.406: v19.05,39.37 v19.05,24.89
  Bottom 0.406: U$4.12 v19.05,39.37 | v19.05,24.89 U$12.14
RRST  (via drill 0.55)
  Top 0.406: v39.37,48.26 v39.37,40.64 | v21.59,40.64 21.59,29.84 27.05,29.84 U$12.12
  Bottom 0.406: U$4.21 54.61,48.26 v39.37,48.26 | v39.37,40.64 v21.59,40.64
V+
  Top 0.406: BAT.2 2.54,43.69 U$2.3
VIN
  Top 0.406: U$11.2 45.21,85.85 41.91,82.55 38.1,82.55 33.02,77.47 21.59,77.47 19.05,74.93 19.05,63.5 U$3.3 13.97,55.88 11.43,53.34 U$2.2 5.08,50.8 5.08,39.37 2.54,36.83 2.54,11.43 12.7,1.27 45.72,1.27 J29.1
  Bottom 0.406: J29.8 J29.7 J29.6 J29.5 J29.4 J29.3 J29.2 J29.1
VSY
  Top 0.406: U$12.3 41.4,9.65 41.91,10.16 41.91,25.4 44.45,27.94 52.07,27.94 52.7,28.57 52.7,36.05 53.86,37.2 53.86,38.85 50.8,41.91 U$4.11
WR  (via drill 0.55)
  Top 0.406: U$4.14 v48.26,29.21
  Bottom 0.406: U$12.10 42.04,27.43 43.81,29.21 v48.26,29.21
WRST  (via drill 0.55)
  Top 0.406: v38.1,30.48 v38.1,50.8
  Bottom 0.406: U$4.22 54.61,50.8 v38.1,50.8 | U$12.11 30.23,30.48 v38.1,30.48

### Text on the board
tPlace: Jose Amador | ME 433 Advanced Mechatronics 2021 | A | B | B | A | < | USB | BAT | + | - | VIN | GND | GND | 3.3V